# Altium schematic sheet STM32.SchDoc
size A; SheetNumber: 10; SheetTotal: 15
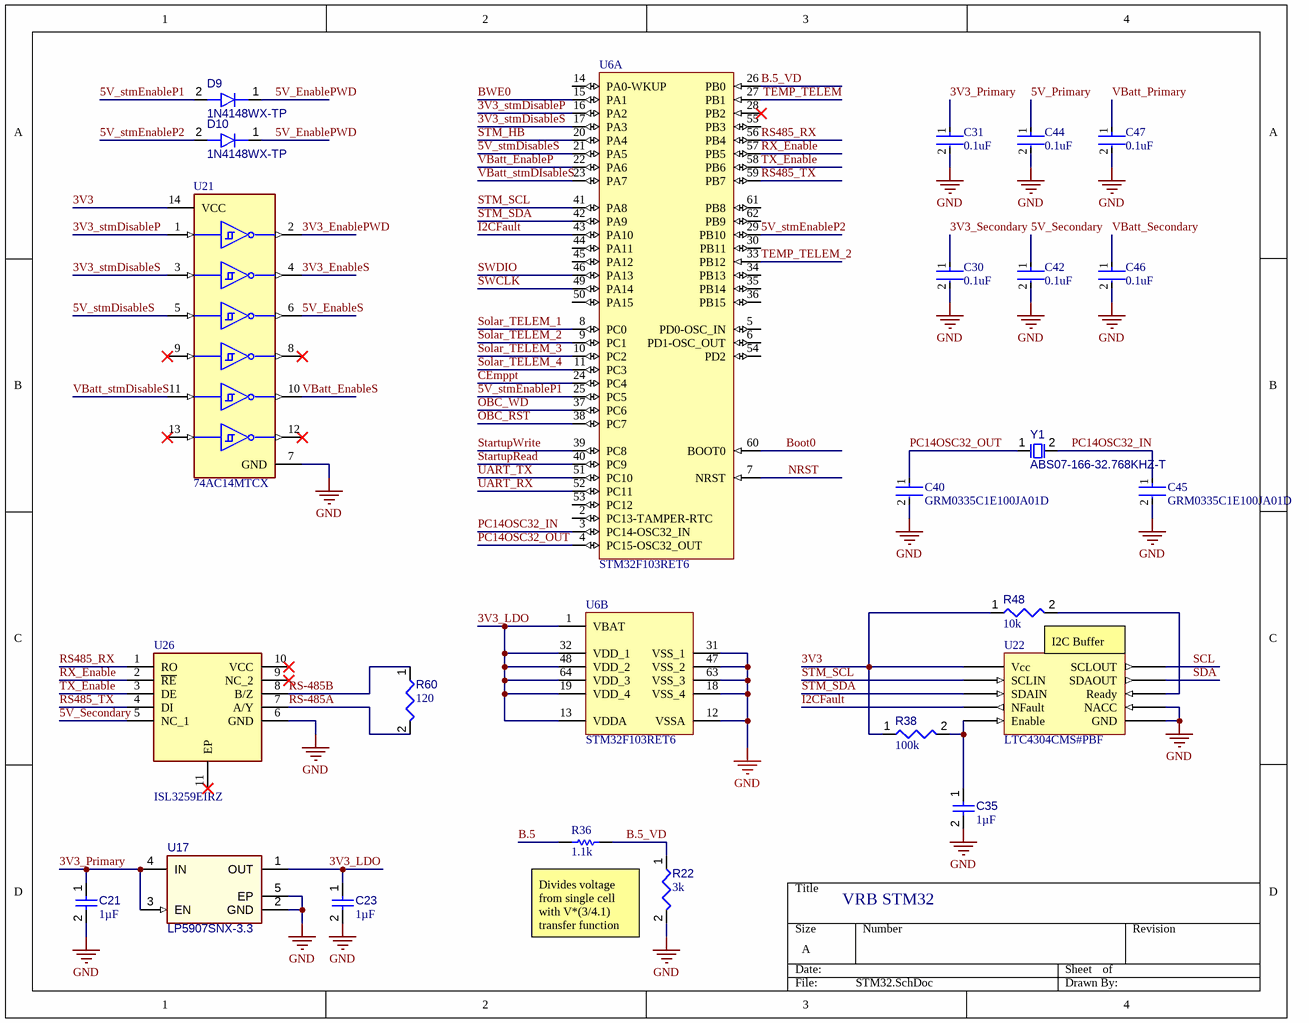
[diagram p0: STM32.SchDoc]

## Parts
C21  value 1µF  [FP-CC0201-BA-IPC_A]  (hidden comment: CC0201KRX5R5BB105)
C23  value 1µF  [FP-CC0201-BA-IPC_A]  (hidden comment: CC0201KRX5R5BB105)
C30  0.1uF  [FP-C0603-CJ-MFG]
C31  0.1uF  [FP-C0603-CJ-MFG]
C35  value 1µF  [CAPC1608X94X35NL15T15]  (hidden comment: Capacitor 1 uF +/- 10% 16 V 0603)
C40  GRM0335C1E100JA01D  [FP-GRM033-0_03-IPC_A]
C42  0.1uF  [FP-C0603-CJ-MFG]
C44  0.1uF  [FP-C0603-CJ-MFG]
C45  GRM0335C1E100JA01D  [FP-GRM033-0_03-IPC_A]
C46  0.1uF  [FP-C0603-CJ-MFG]
C47  0.1uF  [FP-C0603-CJ-MFG]
D9  1N4148WX-TP  [1N4148WX-TP-Footprint-1]
D10  1N4148WX-TP  [1N4148WX-TP-Footprint-1]
R22  value 3k  [RESC0402(1005)_L]  (hidden comment: 3KR2F)
R36  1.1k  [RESC1005X40X25NL05T10]
R38  value 100k  [RESC3216X60X45ML15T20]  (hidden comment: Resistor 100k +/-1% 1206 250 mW)
R48  value 10k  [RESC1608X55X25ML10T15]  (hidden comment: Resistor 10k +/-1% 0603 100 mW)
R60  value 120  [RESC0603(1608)_L]  (hidden comment: 120R3J)
U6  STM32F103RET6  [STM-LQFP64_N]  (parts A,B of 2)
U17  LP5907SNX-3.3  [TI-DQN4-480X480TP_V]
U21  74AC14MTCX  [FP-948G-MFG]
U22  LTC4304CMS#PBF  [LTC4304CMS#PBF-Footprint-1]
U26  ISL3259EIRZ  [ISL3259EIRZ-Footprint-1]
Y1  ABS07-166-32.768KHZ-T  [EPSON-FC-135_V]

## Nets
GND: C21.2 C23.2 C30.2 C31.2 C35.2 C40.2 C42.2 C44.2 C45.2 C46.2 C47.2 R22.2 U6.12(VSSA) U6.18(VSS_4) U6.31(VSS_1) U6.47(VSS_2) U6.63(VSS_3) U17.2(GND) U17.5(EP) U21.7(GND) U22.4(NACC) U22.5(GND) U26.6(GND)
3V3: R38.1 R48.1 U21.14(VCC) U22.10(Vcc)
3V3_EnablePWD: U21.2(~{O}0)
3V3_EnableS: U21.4(~{O}1)
3V3_LDO: C23.1 U6.1(VBAT) U6.13(VDDA) U6.19(VDD_4) U6.32(VDD_1) U6.48(VDD_2) U6.64(VDD_3) U17.1(OUT)
3V3_Primary: C21.1 C31.1 U17.3(EN) U17.4(IN)
3V3_Secondary: C30.1
3V3_stmDisableP: U6.16(PA2) U21.1(I0)
3V3_stmDisableS: U6.17(PA3) U21.3(I1)
5V_EnablePWD: D9.1(K) D10.1(K)
5V_EnableS: U21.6(~{O}2)
5V_Primary: C44.1
5V_Secondary: C42.1 U26.5(NC_1)
5V_stmDisableS: U6.21(PA5) U21.5(I2)
5V_stmEnableP1: D9.2(A) U6.25(PC5)
5V_stmEnableP2: D10.2(A) U6.29(PB10)
B.5: R36.1
B.5_VD: R22.1 R36.2 U6.26(PB0)
Boot0: U6.60(BOOT0)
BWE0: U6.15(PA1)
~{CEmppt}: U6.24(PC4)
I2CFault: U6.43(PA10) U22.7(NFault)
NRST: U6.7(NRST)
OBC_RST: U6.38(PC7)
OBC_WD: U6.37(PC6)
PC14OSC32_IN: C45.1 U6.3(PC14-OSC32_IN) Y1.2
PC14OSC32_OUT: C40.1 U6.4(PC15-OSC32_OUT) Y1.1
~{RX_Enable}: U6.57(PB5) U26.2(~{RE})
RS485_RX: U6.56(PB4) U26.1(RO)
RS485_TX: U6.59(PB7) U26.4(DI)
RS-485A: R60.2 U26.7(A/Y)
RS-485B: R60.1 U26.8(B/Z)
SCL: U22.2(SCLOUT)
SDA: U22.9(SDAOUT)
Solar_TELEM_1: U6.8(PC0)
Solar_TELEM_2: U6.9(PC1)
Solar_TELEM_3: U6.10(PC2)
Solar_TELEM_4: U6.11(PC3)
StartupRead: U6.40(PC9)
StartupWrite: U6.39(PC8)
STM_HB: U6.20(PA4)
STM_SCL: U6.41(PA8) U22.3(SCLIN)
STM_SDA: U6.42(PA9) U22.8(SDAIN)
SWCLK: U6.49(PA14)
SWDIO: U6.46(PA13)
TEMP_TELEM: U6.27(PB1)
TEMP_TELEM_2: U6.33(PB12)
TX_Enable: U6.58(PB6) U26.3(DE)
UART_RX: U6.52(PC11)
UART_TX: U6.51(PC10)
VBatt_EnableP: U6.22(PA6)
VBatt_EnableS: U21.10(~{O}4)
VBatt_Primary: C47.1
VBatt_Secondary: C46.1
VBatt_stmDIsableS: U6.23(PA7) U21.11(I4)
NetC35_1: C35.1 R38.2 U22.1(Enable)
NetR48_2: R48.2 U22.6(Ready)

Not connected (* = marked no-connect by the designer): U6 2(PC13-TAMPER-RTC) 5(PD0-OSC_IN) 6(PD1-OSC_OUT) 14(PA0-WKUP) 28(PB2)* 30(PB11) 34(PB13) 35(PB14) 36(PB15) 44(PA11) 45(PA12) 50(PA15) 53(PC12) 54(PD2) 55(PB3) 61(PB8) 62(PB9); U21 8(~{O}3)* 9(I3)* 12(~{O}5)* 13(I5)*; U26 9(NC_2)* 10(VCC)* 11(EP)*

## Notes on the sheet
- I2C Buffer
- VRB STM32
- Divides voltage from single cell with V*(3/4.1) transfer function

## Library data of the parts
C21 C23 = CMP-001-00088-1: Ceramic Capacitor, Multilayer, Ceramic, 6.3V, 10% +Tol, 10% -Tol, X5R, 15% TC, 1uF, Surface Mount, 0201; Capacitor Type: Ceramic; Max Operating Temperature: 85°C; RoHS Compliant: Yes; Mounting Technology: Surface Mount; Min Operating Temperature: -55°C; Case/Package: 0201; Pins: 2
C30 C31 C42 C44 C46 C47 = CMP-2006-03300-2: CAP CER 0.1UF 50V X7R 0603 / C0603X104K5RACTU; Manufacturer: Kemet; Capacitance: 100nF; Material: Ceramic; Tolerance: 10%; Value: 100nF; Temperature Coefficient: 15%; Temperature Range High: +125°C; Temperature Range Low: -55°C; Manufacturer Part Number: C0603X104K5RACTU; Voltage: 50V; ComponentLink2Description: Datasheet; RoHS: TRUE; ComponentLink2URL: https://content.kemet.com/datasheets/KEM_C1013_X7R_FT-CAP_SMD.pdf; Device Class L3: Ceramic Capacitors; Device Class L2: Capacitors; Package: C0603-CJ; Height: 0.95mm; Device Class L1: Passive Components; Temperature Characteristic: X7R; Lead Free: Yes; Digikey Description: CAP CER 0.1UF 50V X7R 0603; Automotive: No; Mouser Description: Capacitor; Ceramic; Cap 0.1uF; Tol+10%; SMT; Flexible Termination; Vol-Rtg 50V; TR; Temperature: -55°C to +125°C; Octopart: https://octopart.com/c0603x104k5ractu-kemet-9145062; Category: Cap; Voltage Rating: 50V; Ipc Land Pattern Name: CAPC16080X80
C35 = CMP-001-00003-6: Chip Capacitor, 1 uF, +/- 10%, 16 V, 0603 (1608 Metric); Voltage Rating: 16V; Capacitor Type: Ceramic; Max Operating Temperature: 125°C; Pins: 2; Tolerance: 10%; Min Operating Temperature: -55°C; RoHS Compliant: True; Mounting Technology: SM; Case/Package: 0603
C40 C45 = CMP-2010-01302-2: Chip Multilayer Ceramic Capacitors for General Purpose, 0201, 10pF, C0G, 30ppm/°C, 5%, 25V; Length: 0.024inch; Voltage Rating: 25V; Packaging: Tape and Reel; Max Operating Temperature: 125°C; Mount: Surface Mount; Capacitance: 10pF; Tolerance: 5%; Series: GRM; Case Code (Metric): 0603; Package Quantity: 1; Voltage Rating (DC): 25V; Depth: 0.3mm; Min Operating Temperature: -55°C; Width: 0.012inch; Thickness: 0.013inch; Termination: SMD/SMT; Lead Free: Lead Free; Case/Package: 0201; Case Code (Imperial): 0201; Dielectric: C0G; REACH SVHC: No SVHC
D9 = CMP-004-00035-2: Rectifier Diode, 1 Phase, 1 Element, 0.15A, 100V V(RRM), Silicon
D10 = CMP-004-00035-3: Rectifier Diode, 1 Phase, 1 Element, 0.15A, 100V V(RRM), Silicon
R22 = CMP-009-00099-2: 3K 0.063W 1% 0402 (1005 Metric)  SMD; Power: 63mW; Case/Package: 0402; Tolerance: 1%; Mounting Technology: SMT; Pins: 2
R36 = CMP-2002-07452-1: Part Number: RC0402FR-071K1L; Manufacturer: Yageo / Phycomp
R38 = CMP-009-00025-5: Chip Resistor, 100 KOhm, +/- 1%, 0.25 W, -55 to 155 degC, 1206 (3216 Metric); Voltage Rating: 200V; Power: 250mW; RoHS Compliant: True; Max Operating Temperature: 155°C; Pins: 2; Tolerance: 1%; Mounting Technology: SM; Case/Package: 1206; Min Operating Temperature: -55°C
R48 = CMP-009-00017-5: Chip Resistor, 10 KOhm, +/- 1%, 01 W, -55 to 155 degC, 0603 (1608 Metric); Voltage Rating: 50V; Power: 100mW; RoHS Compliant: True; Min Operating Temperature: -55°C; Pins: 2; Case/Package: 0603; Mounting Technology: SM; Max Operating Temperature: 155°C; Tolerance: 1%
R60 = CMP-009-00069-2: 120R 0.1W 5% 0603 (1608 Metric)  SMD; Power: 100mW; Mounting Technology: SMT; Tolerance: 5%; Case/Package: 0603; Pins: 2
U6 = CMP-0237-00201-3: ARM Cortex-M3 32-bit MCU, 512 KB Flash, 64 KB Internal RAM, 51 I/Os, 64-pin LQFP, -40 to 85 degC, Tray; FLASH Size (Prog) (kB): 512; Internal RAM Size (kB): 64; A/D Converter: 3x12-bit (16 Channel); I/Os (High Current): 51; Supply Voltage(Vcc) min (V): 2; D/A Converter: 2x12-bit (2 Channel); Operating Frequency(F) (Processor speed) (MHz): 72; PackageDescription: 64-Pin Low Profile Quad Flat Package, 10 x 10 mm Body, 0.5 mm Pitch; ComponentLink3URL: http://www.st.com/st-web-ui/static/active/en/resource/technical/document/datasheet/DM00037051.pdf; DatasheetVersion: Rev. 8; Packing: Tray; PackageReference: LQFP64; ComponentLink3Description: Package Specification; Core: ARM Cortex-M3; Mounting Technology: Surface Mount; PartNumber: STM32F103RET6; PackageVersion: Rev. 4, 06/2013; ComponentLink1URL: http://www.st.com/web/en/home.html; ComponentLink1Description: Manufacturer URL; ComponentLink2Description: Datasheet; ComponentLink2URL: http://www.st.com/st-web-ui/static/active/en/resource/technical/document/datasheet/CD00191185.pdf
U17 = CMP-019-00040-3: Ultra-Low-Noise, Low-IQ LDO, 3.3 V, 0.25 A, -40 to 125 degC, 4-Pin X2SON, RoHS, Tape and Reel; Output Voltage: 3.3V; Pins: 5; Max Operating Temperature: 125°C; Min Operating Temperature: -40°C
U21 = CMP-016-00013-1: Inverter, AC Series, 6-Func, 1-Input, CMOS, PDSO14; Min Supply Voltage: 2V; Nominal Supply Voltage: 3.3V; Max Supply Voltage: 6V; RoHS Compliant: Yes; Case/Package: TSSOP; Min Operating Temperature: -40°C; Max Operating Temperature: 85°C; Pins: 14; Logic Type: INVERTER
U22 = CMP-015-00009-7: Interface Circuit, PDSO10; Max Supply Voltage: 5.5V; Min Supply Voltage: 2.7V; Nominal Supply Voltage: 3.3V; RoHS Compliant: Yes; Max Operating Temperature: 70°C; Min Operating Temperature: 0°C; Pins: 10; Case/Package: TSSOP
U26 = CMP-015-00010-2: Line Transceiver, 1 Func, 1 Driver, 1 Rcvr, BICMOS, PDSO10; Min Supply Voltage: 4.75V; Nominal Supply Voltage: 5V; Max Supply Voltage: 5.25V; Case/Package: HVSON; RoHS Compliant: Yes; Pins: 10; Max Operating Temperature: 85°C; Min Operating Temperature: -40°C
Y1 = CMP-003-00029-1: Crystal 32.768kHz 10ppm 7pF -40C +85C; Pins: 2; Frequency: 32.768kHz